# Altium schematic sheet [1] - CONTROL BOARD.SchDoc: Control Board
size A4; CheckedBy: Rafael Lang; CompanyName: Gear Labs; DrawnBy: Pedro Neves; Organization: Gear Labs; DocumentNumber: 001/2017; Revision: v1.0; SheetNumber: 1; SheetTotal: 6
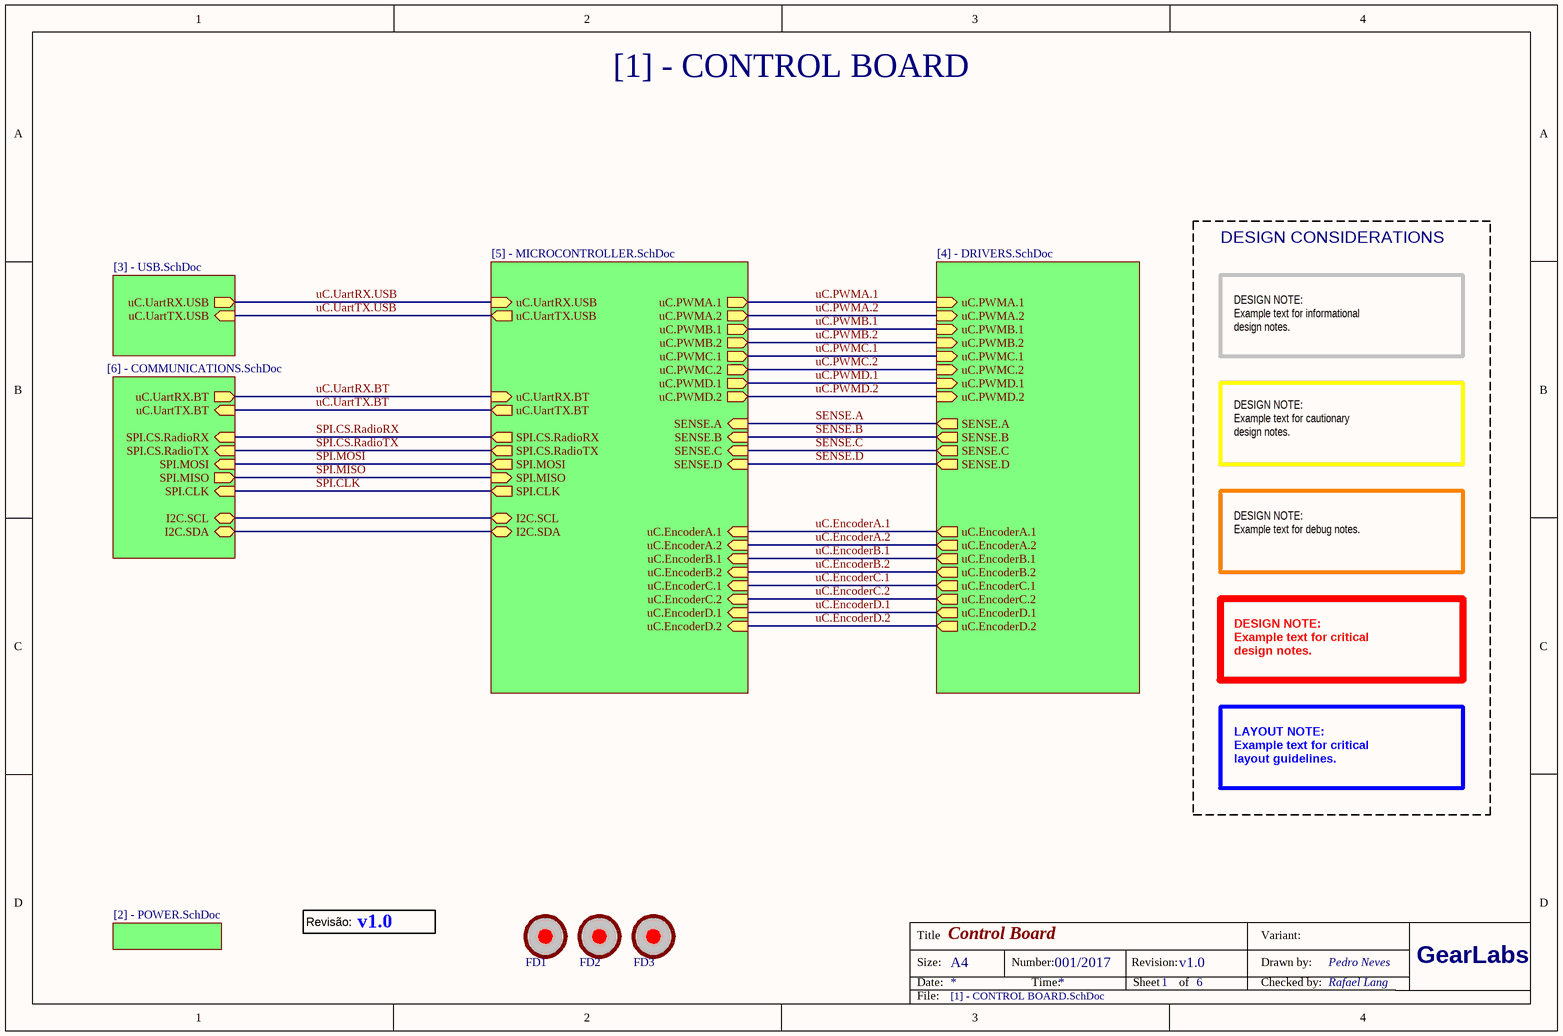
[diagram p0: [1] - CONTROL BOARD.SchDoc]

## Parts
FD1  Fiducial  [Fiducial]  (value not drawn)  (no BOM)
FD2  Fiducial  [Fiducial]  (value not drawn)  (no BOM)
FD3  Fiducial  [Fiducial]  (value not drawn)  (no BOM)
Info1  v1.0  (value not drawn)  (graphical)

## Sub-sheets
Communications = [6] - COMMUNICATIONS.SchDoc: uC.UartRX.BT (out), uC.UartTX.BT (in), SPI.CS.RadioRX (in), SPI.CS.RadioTX (in), SPI.MOSI (in), SPI.MISO (out), SPI.CLK (in), I2C.SCL (bidir), I2C.SDA (bidir)
Driver = [4] - DRIVERS.SchDoc: SENSE.C (out), SENSE.A (out), SENSE.B (out), SENSE.D (out), uC.PWMA.1 (in), uC.EncoderC.2 (out), uC.EncoderC.1 (out), uC.EncoderA.2 (out), uC.EncoderA.1 (out), uC.EncoderB.1 (out), uC.EncoderD.1 (out), uC.EncoderD.2 (out), uC.EncoderB.2 (out), uC.PWMA.2 (in), uC.PWMB.1 (in), uC.PWMB.2 (in), uC.PWMC.1 (in), uC.PWMC.2 (in), uC.PWMD.1 (in), uC.PWMD.2 (in)
Power = [2] - POWER.SchDoc: no entries
uC = [5] - MICROCONTROLLER.SchDoc: SPI.CS.RadioRX (out), SPI.CS.RadioTX (out), SPI.MISO (in), uC.EncoderD.2 (in), SPI.CLK (out), uC.UartRX.BT (in), uC.PWMC.1 (out), uC.EncoderA.1 (in), uC.EncoderC.2 (in), uC.EncoderD.1 (in), uC.UartTX.BT (out), SPI.MOSI (out), uC.UartTX.USB (out), uC.PWMA.2 (out), uC.EncoderC.1 (in), uC.PWMC.2 (out), uC.PWMB.1 (out), uC.UartRX.USB (in), uC.PWMB.2 (out), uC.EncoderB.1 (in), uC.EncoderB.2 (in), uC.PWMA.1 (out), uC.PWMD.2 (out), uC.EncoderA.2 (in), uC.PWMD.1 (out), SENSE.C (in), SENSE.A (in), SENSE.B (in), SENSE.D (in), I2C.SCL (bidir), I2C.SDA (bidir)
USB = [3] - USB.SchDoc: uC.UartTX.USB (in), uC.UartRX.USB (out)

## Nets
SENSE.A: sheet uC/SENSE.A, sheet Driver/SENSE.A
SENSE.B: sheet uC/SENSE.B, sheet Driver/SENSE.B
SENSE.C: sheet uC/SENSE.C, sheet Driver/SENSE.C
SENSE.D: sheet uC/SENSE.D, sheet Driver/SENSE.D
SPI.CLK: sheet uC/SPI.CLK, sheet Communications/SPI.CLK
SPI.CS.RadioRX: sheet uC/SPI.CS.RadioRX, sheet Communications/SPI.CS.RadioRX
SPI.CS.RadioTX: sheet uC/SPI.CS.RadioTX, sheet Communications/SPI.CS.RadioTX
SPI.MISO: sheet uC/SPI.MISO, sheet Communications/SPI.MISO
SPI.MOSI: sheet uC/SPI.MOSI, sheet Communications/SPI.MOSI
uC.EncoderA.1: sheet uC/uC.EncoderA.1, sheet Driver/uC.EncoderA.1
uC.EncoderA.2: sheet uC/uC.EncoderA.2, sheet Driver/uC.EncoderA.2
uC.EncoderB.1: sheet uC/uC.EncoderB.1, sheet Driver/uC.EncoderB.1
uC.EncoderB.2: sheet uC/uC.EncoderB.2, sheet Driver/uC.EncoderB.2
uC.EncoderC.1: sheet uC/uC.EncoderC.1, sheet Driver/uC.EncoderC.1
uC.EncoderC.2: sheet uC/uC.EncoderC.2, sheet Driver/uC.EncoderC.2
uC.EncoderD.1: sheet uC/uC.EncoderD.1, sheet Driver/uC.EncoderD.1
uC.EncoderD.2: sheet uC/uC.EncoderD.2, sheet Driver/uC.EncoderD.2
uC.PWMA.1: sheet uC/uC.PWMA.1, sheet Driver/uC.PWMA.1
uC.PWMA.2: sheet uC/uC.PWMA.2, sheet Driver/uC.PWMA.2
uC.PWMB.1: sheet uC/uC.PWMB.1, sheet Driver/uC.PWMB.1
uC.PWMB.2: sheet uC/uC.PWMB.2, sheet Driver/uC.PWMB.2
uC.PWMC.1: sheet uC/uC.PWMC.1, sheet Driver/uC.PWMC.1
uC.PWMC.2: sheet uC/uC.PWMC.2, sheet Driver/uC.PWMC.2
uC.PWMD.1: sheet uC/uC.PWMD.1, sheet Driver/uC.PWMD.1
uC.PWMD.2: sheet uC/uC.PWMD.2, sheet Driver/uC.PWMD.2
uC.UartRX.BT: sheet uC/uC.UartRX.BT, sheet Communications/uC.UartRX.BT
uC.UartRX.USB: sheet uC/uC.UartRX.USB, sheet USB/uC.UartRX.USB
uC.UartTX.BT: sheet uC/uC.UartTX.BT, sheet Communications/uC.UartTX.BT
uC.UartTX.USB: sheet uC/uC.UartTX.USB, sheet USB/uC.UartTX.USB
(unnamed): sheet uC/I2C.SCL, sheet Communications/I2C.SCL
(unnamed): sheet uC/I2C.SDA, sheet Communications/I2C.SDA

## Notes on the sheet
- [1] - CONTROL BOARD
- DESIGN CONSIDERATIONS
- DESIGN NOTE:
  Example text for informational
  design notes.
- DESIGN NOTE:
  Example text for cautionary
  design notes.
- DESIGN NOTE:
  Example text for debug notes.
- DESIGN NOTE:
  Example text for critical
  design notes.
- LAYOUT NOTE:
  Example text for critical
  layout guidelines.
- Title
- Size:
- Date:
- A4
- Number:
- Time:
- Revision:
- Sheet
- of
- Drawn by:
- Checked by:
- Variant:
- GearLabs
- File:
- (in symbol Versionamento) Revisão:

## Library data of the parts
Info1 = Versionamento